# EAGLE design RX (EAGLE 6.5.0)
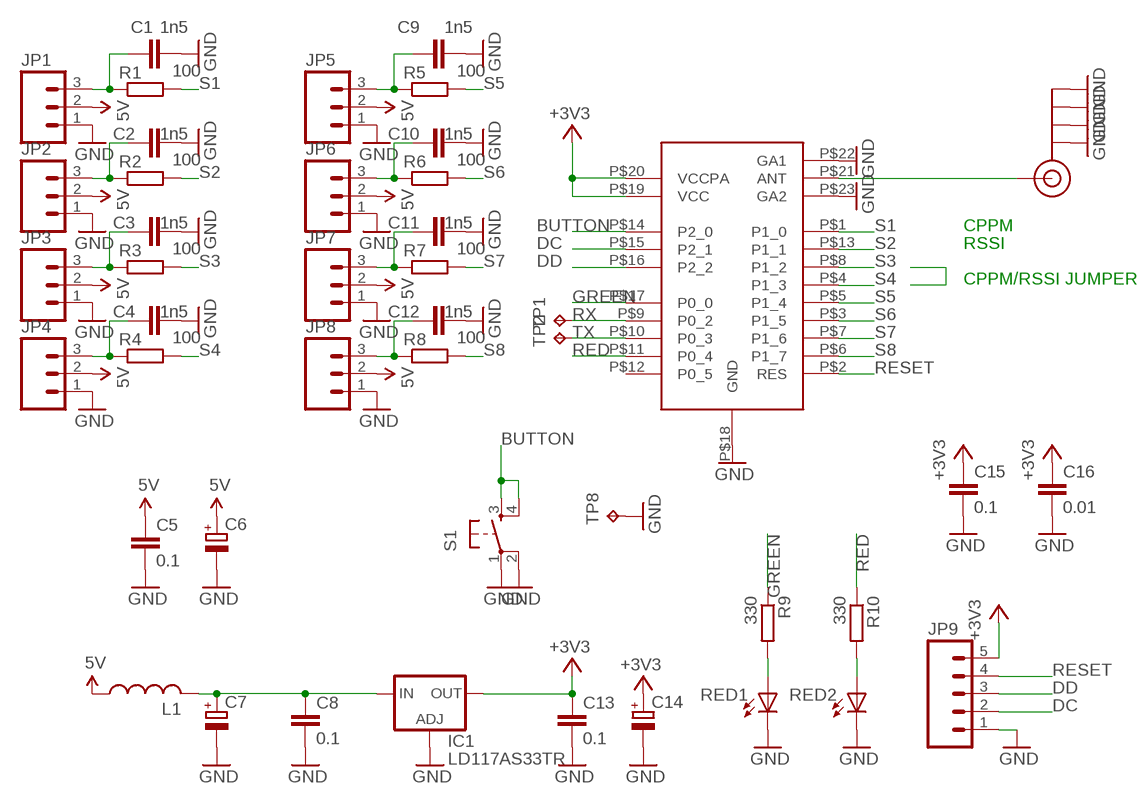
[diagram p0: schematic, sheet 1]

## Parts
C1  1n5  C-EUC0603  [C0603]
C2  1n5  C-EUC0603  [C0603]
C3  1n5  C-EUC0603  [C0603]
C4  1n5  C-EUC0603  [C0603]
C5  0.1  C-EUC0603  [C0603]
C6  CPOL-EUCT3216  [CT3216]
C7  CPOL-EUCT3216  [CT3216]
C8  0.1  C-EUC0603  [C0603]
C9  1n5  C-EUC0603  [C0603]
C10  1n5  C-EUC0603  [C0603]
C11  1n5  C-EUC0603  [C0603]
C12  1n5  C-EUC0603  [C0603]
C13  0.1  C-EUC0603  [C0603]
C14  CPOL-EUCT3216  [CT3216]
C15  0.1  C-EUC0603  [C0603]
C16  0.01  C-EUC0603  [C0603]
IC1  LD117AS33TR  [SOT223]
J$1  SMA_EDGE  [SMA-EDGE]
JP1  M03PTH  [1X03]
JP2  M03PTH  [1X03]
JP3  M03PTH  [1X03]
JP4  M03PTH  [1X03]
JP5  M03PTH  [1X03]
JP6  M03PTH  [1X03]
JP7  M03PTH  [1X03]
JP8  M03PTH  [1X03]
JP9  M05PTH  [1X05]
L1  L-USL2012C  [L2012C]
R1  100  R-EU_MELF0102R  [MINI_MELF-0102R]
R2  100  R-EU_MELF0102R  [MINI_MELF-0102R]
R3  100  R-EU_MELF0102R  [MINI_MELF-0102R]
R4  100  R-EU_MELF0102R  [MINI_MELF-0102R]
R5  100  R-EU_MELF0102R  [MINI_MELF-0102R]
R6  100  R-EU_MELF0102R  [MINI_MELF-0102R]
R7  100  R-EU_MELF0102R  [MINI_MELF-0102R]
R8  100  R-EU_MELF0102R  [MINI_MELF-0102R]
R9  330  R-EU_MELF0102R  [MINI_MELF-0102R]
R10  330  R-EU_MELF0102R  [MINI_MELF-0102R]
RED1  LEDCHIPLED_1206  [CHIPLED_1206]
RED2  LEDCHIPLED_1206  [CHIPLED_1206]
S1  TAC_SWITCHSMD  [TACTILE_SWITCH_SMD]
TP1  TPB1,27  [B1,27]
TP2  TPB1,27  [B1,27]
TP8  TPB1,27  [B1,27]
U$1  CC1110_PA  [CC1110_PA]

## Nets
5V: C5.1 C6.+ JP1.2 JP2.2 JP3.2 JP4.2 JP5.2 JP6.2 JP7.2 JP8.2 L1.1
+3V3: C13.1 C14.+ C15.1 C16.1 IC1.4(OUT) JP9.5 U$1.P$19(VCC) U$1.P$20(VCCPA)
BUTTON: S1.3 S1.4 U$1.P$14(P2_0)
DC: JP9.2 U$1.P$15(P2_1)
DD: JP9.3 U$1.P$16(P2_2)
GND: C1.2 C2.2 C3.2 C4.2 C5.2 C6.- C7.- C8.2 C9.2 C10.2 C11.2 C12.2 C13.2 C14.- C15.2 C16.2 IC1.1(ADJ) J$1.GND@0(GND) J$1.GND@1(GND) J$1.GND@2(GND) J$1.GND@3(GND) JP1.1 JP2.1 JP3.1 JP4.1 JP5.1 JP6.1 JP7.1 JP8.1 JP9.1 RED1.C RED2.C S1.1 S1.2 TP8.TP U$1.P$18(GND) U$1.P$22(GA1) U$1.P$23(GA2)
GREEN: R9.1 U$1.P$17(P0_0)
N$1: J$1.SIG(SIGNAL) U$1.P$21(ANT)
N$2: C7.+ C8.1 IC1.3(IN) L1.2
N$3: R9.2 RED1.A
N$4: R10.2 RED2.A
N$5: C9.1 JP5.3 R5.1
N$6: C10.1 JP6.3 R6.1
N$7: C11.1 JP7.3 R7.1
N$8: C12.1 JP8.3 R8.1
N$9: C1.1 JP1.3 R1.1
N$10: C2.1 JP2.3 R2.1
N$11: C3.1 JP3.3 R3.1
N$12: C4.1 JP4.3 R4.1
RED: R10.1 U$1.P$11(P0_4)
RESET: JP9.4 U$1.P$2(RES)
RX: TP1.TP U$1.P$9(P0_2)
S1: R1.2 U$1.P$1(P1_0)
S2: R2.2 U$1.P$13(P1_1)
S3: R3.2 U$1.P$8(P1_2)
S4: R4.2 U$1.P$4(P1_3)
S5: R5.2 U$1.P$5(P1_4)
S6: R6.2 U$1.P$3(P1_5)
S7: R7.2 U$1.P$7(P1_6)
S8: R8.2 U$1.P$6(P1_7)
TX: TP2.TP U$1.P$10(P0_3)
Unconnected: U$1.P$12(P0_5)

## Notes on the sheet
- CPPM
- RSSI
- CPPM/RSSI JUMPER

## Library data of the parts
C1-C5 C8-C13 C15 C16 = resistor:C-EU: CAPACITOR, European symbol
C6 C7 C14 = rcl:CPOL-EU: POLARIZED CAPACITOR, European symbol
IC1 = v-reg:LD117A?*: Low drop fixed and adjustable positive voltage regulators 1 A Source: http://www.st.com/stonline/products/literature/ds/7194/ld1117axx.pdf
J$1 = SparkFun:SMA_EDGE: SMA Antenna Connector End launch SMA connector. The paste layer has been removed so that the connector can be hand soldered onto the board after reflow.
JP1-JP8 = SparkFun-Connectors:M03: Header 3 Standard 3-pin 0.1" header. Use with straight break away headers (SKU : PRT-00116), right angle break away headers (PRT-00553), swiss pins (PRT-00743), machine pins (PRT-00117), and female headers (PRT-00115). Molex polarized connector foot print use with SKU : PRT-08232 with associated crimp pins and housings.
JP9 = SparkFun-Connectors:M05: Header 5 Standard 5-pin 0.1" header. Use with straight break away headers (SKU : PRT-00116), right angle break away headers (PRT-00553), swiss pins (PRT-00743), machine pins (PRT-00117), and female headers (PRT-00115). Molex polarized connector foot print use with SKU : PRT-08230 with associated crimp pins and housings.
L1 = resistor:L-US: INDUCTOR, American symbol
R1-R10 = resistor:R-EU_: RESISTOR, European symbol
RED1 RED2 = led:LED: LED OSRAM: - CHIPLED LG R971, LG N971, LY N971, LG Q971, LY Q971, LO R971, LY R971 LH N974, LH R974 LS Q976, LO Q976, LY Q976 LO Q996 - Hyper CHIPLED LW Q18S LB Q993, LB Q99A, LB R99A - SideLED LS A670, LO A670, LY A670, LG A670, LP A670 LB A673, LV A673, LT A673, LW A673 LH A674 LY A675 LS A676, LA A676, LO A676, LY A676, LW A676 LS A679, LY A679, LG A679 - Hyper Micro SIDELED® LS Y876, LA Y876, LO Y876, LY Y876 LT Y87S - SmartLED LW L88C, LW L88S LB L89C, LB L89S, LG L890 LS L89K, LO L89K, LY L89K LS L896, LA L896, LO L896, LY L896 - TOPLED LS T670, LO T670, LY T670, LG T670, LP T670 LSG T670, LSP T670, LSY T670, LOP T670, LYG T670 LG T671, LOG T671, LSG T671 LB T673, LV T673, LT T673, LW T673 LH T674 LS T676, LA T676, LO T676, LY T676, LB T676, LH T676, LSB T676, LW T676 LB T67C, LV T67C, LT T67C, LS T67K, LO T67K, LY T67K, LW E67C LS E67B, LA E67B, LO E67B, LY E67B, LB E67C, LV E67C, LT E67C LW T67C LS T679, LY T679, LG T679 LS T770, LO T770, LY T770, LG T770, LP T770 LB T773, LV T773, LT T773, LW T773 LH T774 LS E675, LA E675, LY E675, LS T675 LS T776, LA T776, LO T776, LY T776, LB T776 LHGB T686 LT T68C, LB T68C - Hyper Mini TOPLED® LB M676 - Mini TOPLED Santana® LG M470 LS M47K, LO M47K, LY M47K Source: http://www.osram.convergy.de LUXEON: - LUMILED® LXK2-PW12-R00, LXK2-PW12-S00, LXK2-PW14-U00, LXK2-PW14-V00 LXK2-PM12-R00, LXK2-PM12-S00, LXK2-PM14-U00 LXK2-PE12-Q00, LXK2-PE12-R00, LXK2-PE12-S00, LXK2-PE14-T00, LXK2-PE14-U00 LXK2-PB12-K00, LXK2-PB12-L00, LXK2-PB12-M00, LXK2-PB14-N00, LXK2-PB14-P00, LXK2-PB14-Q00 LXK2-PR12-L00, LXK2-PR12-M00, LXK2-PR14-Q00, LXK2-PR14-R00 LXK2-PD12-Q00, LXK2-PD12-R00, LXK2-PD12-S00 LXK2-PH12-R00, LXK2-PH12-S00 LXK2-PL12-P00, LXK2-PL12-Q00, LXK2-PL12-R00 Source: www.luxeon.com KINGBRIGHT: KA-3528ASYC Source: www.kingbright.com
S1 = SparkFun-Electromechanical:TAC_SWITCH: Momentary Switch Button commonly used for reset or general input. Spark Fun Electronics SKU : COM-00097 SMT- SWCH-08247; PROD_ID: SWCH-08247
TP1 TP2 TP8 = testpad:TP: Test pad
U$1 = Stefan:CC1110_PA

## Board
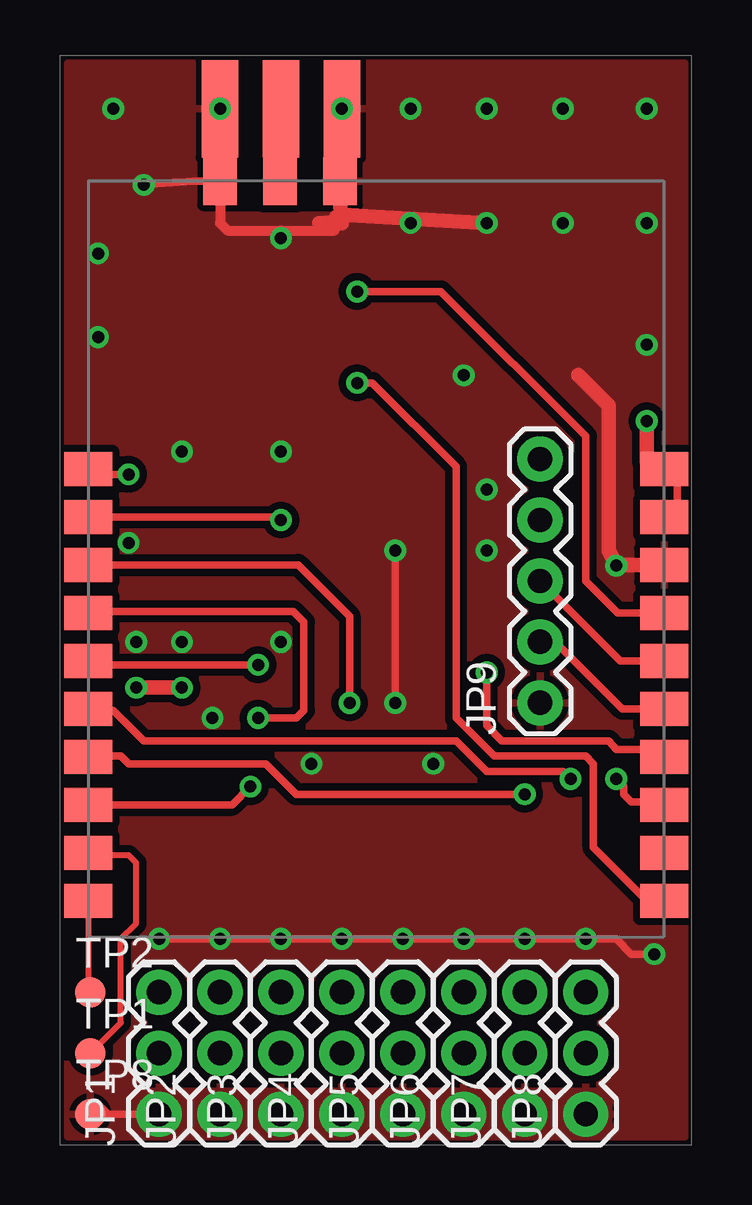
[diagram p1: board, top side]
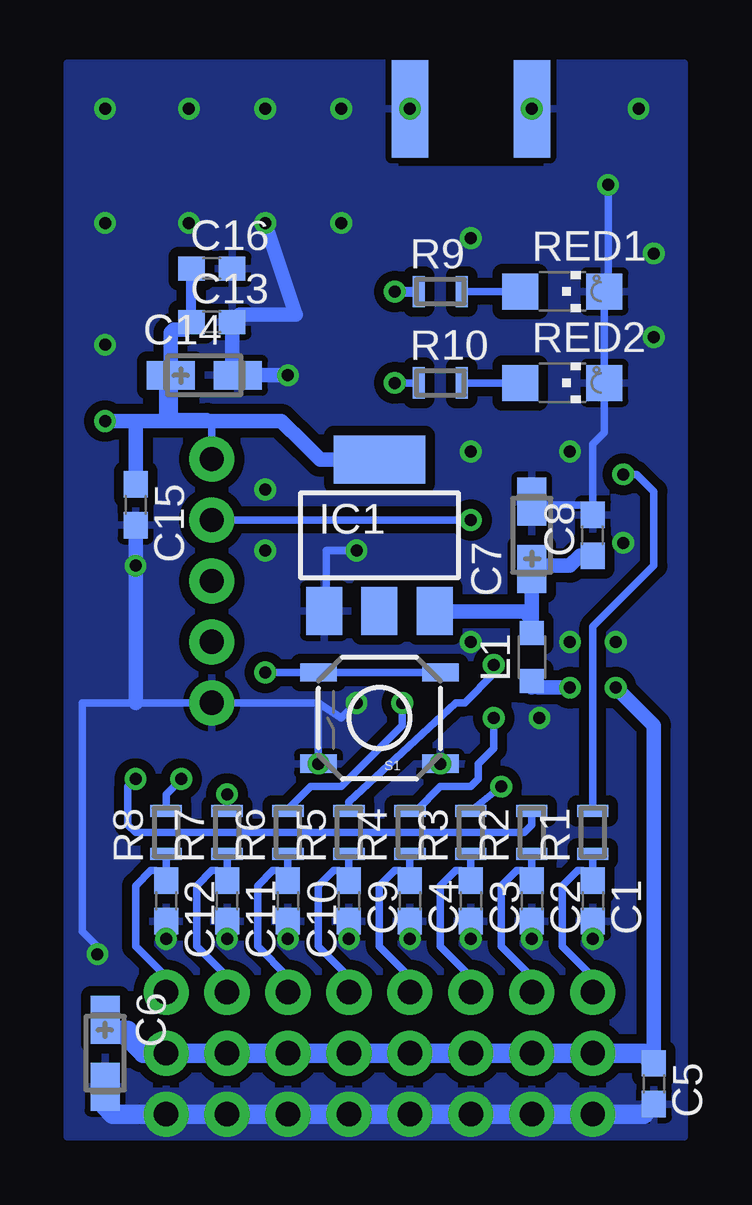
[diagram p2: board, bottom side, seen from below]

No outline drawn. Coordinates in mm, seen from the top.
Copper layers (1*16): Top 0.035mm / dielectric 1.5mm / Bottom 0.035mm
Design rules "default *": minimum track width 10mil, minimum drill 24mil, track to track 8mil, track to pad 8mil, pad to pad 8mil, via to via 8mil, smd to smd 8mil, copper to edge 40mil, drill to drill 8mil, minimum pad ring 10mil, minimum via ring 8mil, stop-mask expansion 4mil, vias tented up to drill 20mil, thermal gap 10mil

### Footprints (pad centres in the part's own frame; a part is rotated, then mirrored left to right if it is on the bottom)
C0603 = smd 1.1 x 1: 1 -0.85,0; 2 0.85,0
CT3216 = smd 2 x 1.2: + -1.4,0; - 1.4,0
SOT223 = smd 1.5 x 2: 1 -2.3,-3.15; 2 0,-3.15; 3 2.3,-3.15 | smd 3.8 x 2: 4 0,3.15
SMA-EDGE = smd 1.524 x 4.064: GND@0 0,0; GND@1 5.08,0; SIG 2.54,0 | smd 1.524 x 4.064 bottom: GND@2 0,0; GND@3 5.08,0
1X03 = drill 1.016 pad 1.88: 1 0,0; 2 2.54,0; 3 5.08,0
1X05 = drill 1.016 pad 1.88: 1 0,0; 2 2.54,0; 3 5.08,0; 4 7.62,0; 5 10.16,0
L2012C = smd 1 x 1: 1 -1,0; 2 1,0
MINI_MELF-0102R = smd 0.5 x 1.3: 1 -0.9,0; 2 0.9,0
CHIPLED_1206 = smd 1.5 x 1.5: A 0,-1.75; C 0,1.75
TACTILE_SWITCH_SMD = smd 1.524 x 0.762: 1 -2.54,1.905; 2 2.54,1.905; 3 -2.54,-1.905; 4 2.54,-1.905
B1,27 = smd 1.27 x 1.27: TP 0,0
CC1110_PA = smd 2 x 1.4: P$1 -5.5,18; P$2 -5.5,16; P$3 -5.5,14; P$4 -5.5,12; P$5 -5.5,10; P$6 -5.5,8; P$7 -5.5,6; P$8 -5.5,4; P$9 -5.5,2; P$10 -5.5,0; P$11 18.5,0; P$12 18.5,2; P$13 18.5,4; P$14 18.5,6; P$15 18.5,8; P$16 18.5,10; P$17 18.5,12; P$18 18.5,14; P$19 18.5,16; P$20 18.5,18 | smd 1.4 x 2: P$21 2.5,30; P$22 0,30; P$23 5,30

### Placement (x,y rotation side)
C1  5.08,11.43 270 bottom
C2  7.62,11.43 270 bottom
C3  10.16,11.43 270 bottom
C4  12.7,11.43 270 bottom
C5  2.54,3.81 270 bottom
C6  25.4,5.08 270 bottom
C7  7.62,26.67 90 bottom
C8  5.08,26.67 90 bottom
C9  15.24,11.43 270 bottom
C10  17.78,11.43 270 bottom
C11  20.32,11.43 270 bottom
C12  22.86,11.43 270 bottom
C13  20.95,35.56 0 bottom
C14  21.27,33.34 0 bottom
C15  24.13,27.94 270 bottom
C16  20.95,37.78 0 bottom
IC1  13.97,26.67 0 bottom
J$1  7.62,44.45 0 top
JP1  5.08,2.54 90 top
JP2  7.62,2.54 90 top
JP3  10.16,2.54 90 top
JP4  12.7,2.54 90 top
JP5  15.24,2.54 90 top
JP6  17.78,2.54 90 top
JP7  20.32,2.54 90 top
JP8  22.86,2.54 90 top
JP9  20.95,19.68 90 top
L1  7.62,21.59 90 bottom
R1  5.08,14.29 90 bottom
R2  7.62,14.29 90 bottom
R3  10.16,14.29 90 bottom
R4  12.7,14.29 90 bottom
R5  15.24,14.29 90 bottom
R6  17.78,14.29 90 bottom
R7  20.32,14.29 90 bottom
R8  22.86,14.29 90 bottom
R9  11.43,36.83 0 bottom
R10  11.43,33.02 0 bottom
RED1  6.35,36.83 270 bottom
RED2  6.35,33.02 270 bottom
S1  13.97,19.05 180 bottom
TP1  2.22,5.08 0 top
TP2  2.22,7.62 0 top
TP8  2.22,2.54 0 top
U$1  7.62,11.43 0 top

### Tracks (layer width: path | path; a pad name or v marks a point on that pad's centre or on a via)
5V  (via drill 0.5)
  Top 0.61: v4.13,20.32 v6.03,20.32
  Bottom 0.61: 7.62,20.32 L1.1 7.35,20.32 v6.03,20.32 | 6.67,5.08 2.54,5.08 2.54,18.73 v4.13,20.32
  Bottom 0.813: C5.1 2.96,5.08 JP1.2 6.67,5.08 JP2.2 JP3.2 JP4.2 JP5.2 JP6.2 JP7.2 JP8.2 23.81,5.08 24.45,5.71 24.45,6.03 24.95,6.03 C6.+
+3V3  (via drill 0.5)
  Top 0.305: 26.67,29.43 26.67,27.3
  Top 0.61: 26.67,29.43 U$1.P$20 25.5,29.75 25.4,29.75 v25.4,31.43 | 26.67,27.3 U$1.P$19
  Bottom 0.305: 22.67,31.62 21.14,31.62 20.95,31.43 JP9.5
  Bottom 0.406: C13.1 C16.1
  Bottom 0.61: C15.1 24.13,31.43 v25.4,31.43 22.86,31.43 | IC1.4 16.43,29.82 17.13,30.51 18.07,31.43 20.95,31.43 22.86,31.43 | 22.86,31.43 22.86,33.15 C14.+ | C14.+ 22.67,35.11 22.54,35.24 22.12,35.24 C13.1 | C14.+ 22.67,31.62 22.86,31.43
BUTTON  (via drill 0.5)
  Top 0.305: U$1.P$14 26.04,17.46 26.35,17.75 24.13,17.75 23.81,18.1 19.37,18.1 18.73,18.73 v18.73,20.95
  Bottom 0.305: v18.73,20.95 S1.4 S1.3
DC
  Top 0.305: U$1.P$15 24.39,19.43 21.59,22.23 JP9.2
DD
  Top 0.305: U$1.P$16 24.29,21.43 JP9.3
GND  (via drill 0.5)
  Top 0.305: v5.08,9.84 v7.62,9.84 v10.16,9.84 v12.7,9.84 v15.24,9.84 v17.78,9.84 v20.32,9.84 v22.86,9.84 24.13,9.84 24.77,9.21 v25.72,9.21 | C5.2 2.96,2.54 JP1.1 | U$1.P$22 6.5,41.43 v4.45,41.27 | v14.92,19.68 v14.92,26.04
  Top 0.406: 13.02,40.01 12.38,40.01 12.38,39.37 7.94,39.37 7.62,39.69 U$1.P$22 J$1.GND@2 | U$1.P$23 12.62,44.37 J$1.GND@3
  Top 0.61: U$1.P$23 12.62,40.4 12.7,39.77 | 12.7,39.77 11.75,39.69 12.7,39.69 12.7,39.77 | 12.7,39.77 12.7,40.01 13.02,40.01 v18.73,39.69 | U$1.P$18 24.42,25.43 v24.13,25.4 23.81,26.04 23.81,32.07 22.54,33.34
  Bottom 0.305: C1.2 v5.08,9.84 | v22.86,9.84 C12.2 | C11.2 v20.32,9.84 | C10.2 v17.78,9.84 | C9.2 v15.24,9.84 | C2.2 v7.62,9.84 | C3.2 v10.16,9.84 | C4.2 v12.7,9.84 | v4.45,41.27 4.45,36.98 RED1.C RED2.C 4.6,30.96 5.08,30.48 5.08,27.94 5.4,27.94 | C8.2 5.08,27.62 5.4,27.94 | 5.4,27.94 7.49,27.94 C7.- | 16.51,19.68 15.56,19.05 v14.92,19.68 | v14.92,26.04 16.19,26.04 16.19,23.6 IC1.1 | S1.2 16.51,19.68 | 16.51,19.68 26.35,19.68 26.35,10.16 25.72,9.53 v25.72,9.21
  Bottom 0.61: v18.73,39.69 17.46,35.88 19.79,35.88 C13.2 20.11,33.57 C14.- v17.78,33.34 | C15.2 v24.13,25.4 24.13,19.68
  Bottom 0.813: C5.2 2.96,2.54 JP1.1 JP2.1 JP3.1 JP4.1 JP5.1 JP6.1 JP7.1 JP8.1 25.08,2.54 25.4,2.86 C6.-
  other vias: 7.62,44.45 12.7,44.45 3.17,44.45 25.4,44.45 18.73,44.45 21.91,44.45 25.4,34.61 6.03,30.16 10.16,39.05 2.54,34.92 10.16,30.16 25.4,39.69 18.73,28.57 18.73,26.04 4.13,22.23 7.3,19.05 10.16,22.23 6.03,22.23 11.43,17.14 16.51,17.14 3.81,26.35 2.54,38.42 21.91,39.69 15.56,44.45 15.56,39.69
  pour Bottom (isolate 0.406): 1.27,46.35 6.99,46.35 6.99,41.91 13.34,41.91 13.34,46.35 26.99,46.35 26.99,1.59 1.27,1.59
  pour Top (isolate 0.305): 1.27,46.35 6.99,46.35 6.99,41.91 7.62,41.91 7.62,40.01 12.7,40.01 12.7,41.91 13.34,41.91 13.34,46.35 26.99,46.35 26.99,1.59 1.27,1.59
  pour Top (isolate 0.305, no thermals): 3.81,3.49 23.81,3.49 23.81,1.59 3.81,1.59
  pour Bottom (isolate 0.305, no thermals): 4.13,3.49 23.81,3.49 23.81,1.59 4.13,1.59
GREEN  (via drill 0.5)
  Top 0.305: U$1.P$17 24.2,23.43 22.86,24.77 22.86,30.8 16.83,36.83 v13.34,36.83
  Bottom 0.406: v13.34,36.83 R9.1
N$1
  Top 0.406: U$1.P$21 10.12,44.41 J$1.SIG
N$2
  Bottom 0.61: C8.1 5.61,25.82 6.03,25.4 7.49,25.4 C7.+ L1.2 7.62,23.18 7.94,23.5 11.64,23.5 IC1.3
N$3
  Bottom 0.305: RED1.A R9.2
N$4
  Bottom 0.305: RED2.A R10.2
N$5
  Bottom 0.305: R5.1 C9.1 15.66,12.7 15.88,12.7 16.51,12.06 16.51,9.53 15.24,8.26 JP5.3
N$6
  Bottom 0.305: R6.1 C10.1 18.2,12.7 18.41,12.7 19.05,12.06 19.05,9.53 17.78,8.26 JP6.3
N$7
  Bottom 0.305: R7.1 C11.1 20.74,12.7 20.95,12.7 21.59,12.06 21.59,9.53 20.32,8.26 JP7.3
N$8
  Bottom 0.305: R8.1 C12.1 23.28,12.7 23.5,12.7 24.13,12.06 24.13,9.53 22.86,8.26 JP8.3
N$9
  Bottom 0.305: R1.1 C1.1 5.5,12.7 5.71,12.7 6.35,12.06 6.35,9.53 5.08,8.26 JP1.3
N$10
  Bottom 0.305: R2.1 C2.1 8.04,12.7 8.26,12.7 8.89,12.06 8.89,9.53 7.62,8.26 JP2.3
N$11
  Bottom 0.305: R3.1 C3.1 10.58,12.7 10.79,12.7 11.43,12.06 11.43,9.53 10.16,8.26 JP3.3
N$12
  Bottom 0.305: R4.1 C4.1 13.12,12.7 13.34,12.7 13.97,12.06 13.97,9.53 12.7,8.26 JP4.3
N$13
  pour Top (isolate 0.305): 3.17,23.5 11.43,23.5 11.17,19.31 10.22,18.41 3.17,18.41
N$14
  pour Top (isolate 0.305): 9.84,17.78 18.41,17.78 18.41,15.88 9.84,15.88
RED  (via drill 0.5)
  Top 0.305: 25.4,11.43 23.18,13.65 23.18,17.14 22.86,17.46 19.05,17.46 17.46,19.05 17.46,29.53 13.97,33.02 v13.34,33.02
  Top 0.406: U$1.P$11 25.4,11.43
  Bottom 0.305: v13.34,33.02 R10.1
RESET  (via drill 0.5)
  Top 0.305: U$1.P$2 10.04,27.43 v10.16,27.3
  Bottom 0.305: v10.16,27.3 JP9.4
RX
  Top 0.254: TP1.TP 3.49,6.35 3.49,9.84 4.13,10.48 4.13,13.02 3.81,13.34 2.21,13.34 U$1.P$9
S1  (via drill 0.5)
  Top 0.305: v3.81,29.21 2.34,29.21 U$1.P$1
  Bottom 0.305: R1.2 5.08,22.86 2.54,25.4 2.54,28.5 3.25,29.21 v3.81,29.21
S2  (via drill 0.5)
  Top 0.305: v24.13,16.51 24.45,16.19 24.45,15.88 24.77,15.56 25.99,15.56 U$1.P$13
  Bottom 0.305: R2.2 7.62,14.61 7.94,14.29 24.13,14.29 24.45,14.61 24.45,16.19 v24.13,16.51
S3  (via drill 0.5)
  Top 0.305: U$1.P$8 8.13,15.43 v8.89,16.19
  Bottom 0.305: v8.89,16.19 R3.2
S4  (via drill 0.5)
  Top 0.305: v9.21,19.05 10.79,19.05 11.11,19.37 11.11,23.05 10.66,23.5 2.19,23.5 U$1.P$4
  Bottom 0.305: R4.2 12.44,15.19 11.43,16.19 10.16,16.19 9.84,16.51 9.84,17.14 9.21,17.78 v9.21,19.05
S5  (via drill 0.5)
  Top 0.305: v9.21,21.27 2.28,21.27 U$1.P$5
  Bottom 0.305: R5.2 15.24,15.56 10.79,19.68 10.42,19.68 9.21,20.9 v9.21,21.27
S6  (via drill 0.5)
  Top 0.305: U$1.P$3 10.87,25.43 13.02,23.29 v13.02,19.68
  Bottom 0.305: R6.2 17.78,15.24 16.83,16.19 15.56,16.19 13.02,18.73 v13.02,19.68
S7  (via drill 0.5)
  Top 0.305: v20.32,15.88 10.79,15.88 9.53,17.14 3.81,17.14 3.49,17.46 2.15,17.46 U$1.P$7
  Bottom 0.305: R7.2 v20.32,15.88
S8  (via drill 0.5)
  Top 0.305: v22.23,16.51 21.91,16.83 18.73,16.83 17.46,18.1 4.45,18.1 3.17,19.37 2.18,19.37 U$1.P$6
  Bottom 0.305: R8.2 22.86,15.88 v22.23,16.51
TX
  Top 0.254: U$1.P$10 2.12,8.04 TP2.TP